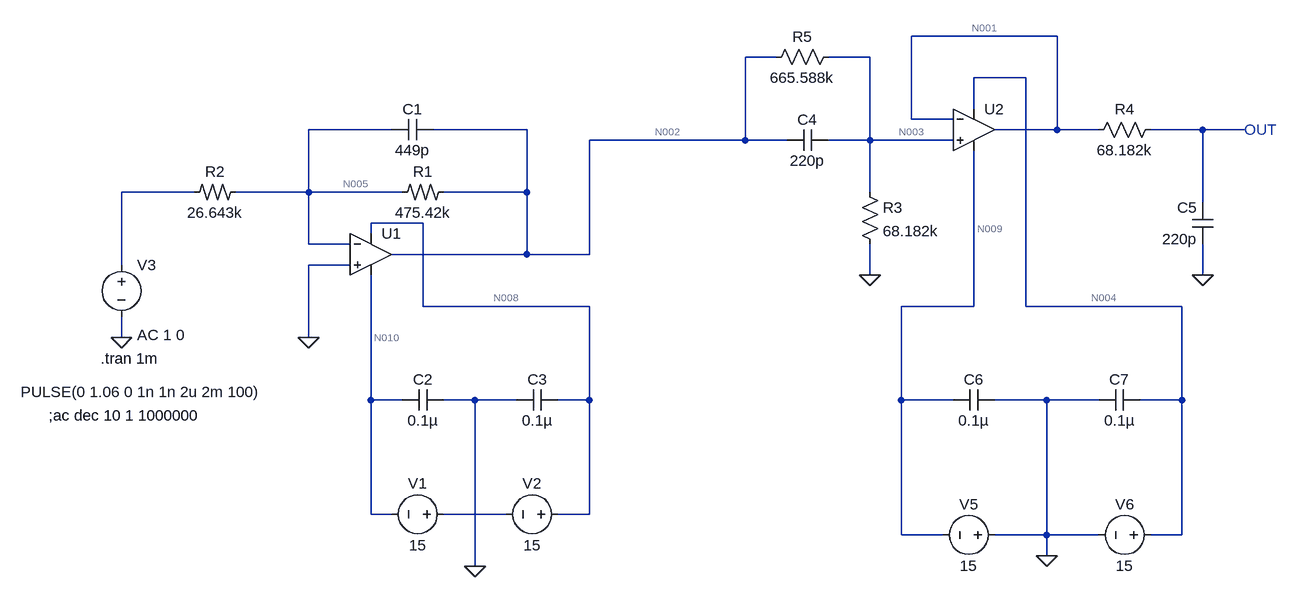
[diagram p0: schematic 3.asc]
3.asc, the LTspice schematic file:
Version 4
SHEET 1 1316 680
WIRE 976 -320 752 -320
WIRE 544 -288 496 -288
WIRE 688 -288 624 -288
WIRE 928 -256 848 -256
WIRE 848 -208 848 -256
WIRE 752 -192 752 -320
WIRE 816 -192 752 -192
WIRE -48 -176 -176 -176
WIRE 160 -176 16 -176
WIRE 976 -176 976 -320
WIRE 976 -176 880 -176
WIRE 1040 -176 976 -176
WIRE 1200 -176 1120 -176
WIRE 1264 -176 1200 -176
WIRE 496 -160 496 -288
WIRE 496 -160 256 -160
WIRE 560 -160 496 -160
WIRE 688 -160 688 -288
WIRE 688 -160 624 -160
WIRE 816 -160 688 -160
WIRE -352 -80 -464 -80
WIRE -176 -80 -176 -176
WIRE -176 -80 -288 -80
WIRE -32 -80 -176 -80
WIRE 160 -80 160 -176
WIRE 160 -80 32 -80
WIRE 688 -80 688 -160
WIRE 1200 -64 1200 -176
WIRE 0 -32 -80 -32
WIRE -80 -16 -80 -32
WIRE -176 0 -176 -80
WIRE -112 0 -176 0
WIRE 160 16 160 -80
WIRE 160 16 -48 16
WIRE 256 16 256 -160
WIRE 256 16 160 16
WIRE -464 32 -464 -80
WIRE -112 32 -176 32
WIRE 688 48 688 0
WIRE 1200 48 1200 0
WIRE 0 96 0 -32
WIRE 256 96 0 96
WIRE 848 96 848 -144
WIRE 848 96 736 96
WIRE 928 96 928 -256
WIRE 1168 96 928 96
WIRE -464 144 -464 112
WIRE -176 144 -176 32
WIRE -80 240 -80 48
WIRE -32 240 -80 240
WIRE 80 240 32 240
WIRE 144 240 80 240
WIRE 256 240 256 96
WIRE 256 240 208 240
WIRE 736 240 736 96
WIRE 816 240 736 240
WIRE 960 240 880 240
WIRE 1040 240 960 240
WIRE 1168 240 1168 96
WIRE 1168 240 1104 240
WIRE -80 416 -80 240
WIRE -48 416 -80 416
WIRE 128 416 32 416
WIRE 256 416 256 240
WIRE 256 416 208 416
WIRE 736 448 736 240
WIRE 800 448 736 448
WIRE 960 448 960 240
WIRE 960 448 880 448
WIRE 1040 448 960 448
WIRE 1168 448 1168 240
WIRE 1168 448 1120 448
WIRE 960 480 960 448
WIRE 80 496 80 240
FLAG -464 144 0
FLAG -176 144 0
FLAG 80 496 0
FLAG 960 480 0
FLAG 688 48 0
FLAG 1200 48 0
SYMBOL Opamps\\UniversalOpamp2 -80 16 R0
SYMATTR InstName U1
SYMATTR Value2 Avol=0.1Meg GBW=4Meg Slew=13Meg
SYMATTR SpiceLine2 en=0 enk=0 in=0 ink=0 Rin=1T
SYMBOL cap 16 -192 R90
WINDOW 0 0 32 VBottom 2
WINDOW 3 32 32 VTop 2
SYMATTR InstName C1
SYMATTR Value 449p
SYMBOL res2 32 -96 R90
WINDOW 0 0 32 VBottom 2
WINDOW 3 32 32 VTop 2
SYMATTR InstName R1
SYMATTR Value 475.42k
SYMBOL res2 -288 -96 R90
WINDOW 0 0 32 VBottom 2
WINDOW 3 32 32 VTop 2
SYMATTR InstName R2
SYMATTR Value 26.643k
SYMBOL cap 32 224 R90
WINDOW 0 0 32 VBottom 2
WINDOW 3 32 32 VTop 2
SYMATTR InstName C2
SYMATTR Value 0.1µ
SYMBOL cap 208 224 R90
WINDOW 0 0 32 VBottom 2
WINDOW 3 32 32 VTop 2
SYMATTR InstName C3
SYMATTR Value 0.1µ
SYMBOL voltage 48 416 R90
WINDOW 0 -32 56 VBottom 2
WINDOW 3 32 56 VTop 2
WINDOW 123 0 0 Left 0
WINDOW 39 0 0 Left 0
SYMATTR InstName V1
SYMATTR Value 15
SYMBOL voltage 224 416 R90
WINDOW 0 -32 56 VBottom 2
WINDOW 3 32 56 VTop 2
WINDOW 123 0 0 Left 0
WINDOW 39 0 0 Left 0
SYMATTR InstName V2
SYMATTR Value 15
SYMBOL voltage -464 16 R0
WINDOW 123 24 124 Left 2
WINDOW 39 0 0 Left 0
WINDOW 3 -155 212 Left 2
SYMATTR Value2 AC 1 0
SYMATTR Value PULSE(0 1.06 0 1n 1n 2u 2m 100)
SYMATTR InstName V3
SYMBOL cap 624 -176 R90
WINDOW 0 0 32 VBottom 2
WINDOW 3 32 32 VTop 2
SYMATTR InstName C4
SYMATTR Value 220p
SYMBOL cap 1216 0 R180
WINDOW 0 24 56 Left 2
WINDOW 3 24 8 Left 2
SYMATTR InstName C5
SYMATTR Value 220p
SYMBOL res 672 -96 R0
SYMATTR InstName R3
SYMATTR Value 68.182k
SYMBOL res 1136 -192 R90
WINDOW 0 0 56 VBottom 2
WINDOW 3 32 56 VTop 2
SYMATTR InstName R4
SYMATTR Value 68.182k
SYMBOL Opamps\\UniversalOpamp2 848 -176 R0
SYMATTR InstName U2
SYMATTR Value2 Avol=0.1Meg GBW=4Meg Slew=13Meg
SYMATTR SpiceLine2 en=0 enk=0 in=0 ink=0 Rin=1T
SYMBOL cap 880 224 R90
WINDOW 0 0 32 VBottom 2
WINDOW 3 32 32 VTop 2
SYMATTR InstName C6
SYMATTR Value 0.1µ
SYMBOL voltage 896 448 R90
WINDOW 0 -32 56 VBottom 2
WINDOW 3 32 56 VTop 2
WINDOW 123 0 0 Left 0
WINDOW 39 0 0 Left 0
SYMATTR InstName V5
SYMATTR Value 15
SYMBOL voltage 1136 448 R90
WINDOW 0 -32 56 VBottom 2
WINDOW 3 32 56 VTop 2
WINDOW 123 0 0 Left 0
WINDOW 39 0 0 Left 0
SYMATTR InstName V6
SYMATTR Value 15
SYMBOL cap 1104 224 R90
WINDOW 0 0 32 VBottom 2
WINDOW 3 32 32 VTop 2
SYMATTR InstName C7
SYMATTR Value 0.1µ
SYMBOL res 640 -304 R90
WINDOW 0 0 56 VBottom 2
WINDOW 3 32 56 VTop 2
SYMATTR InstName R5
SYMATTR Value 665.588k
TEXT -496 176 Left 2 !.tran 1m
TEXT -576 264 Left 2 !;ac dec 10 1 1000000
TEXT 1264 -176 Left 2 ;OUT

The netlist it stands for:
* 3.asc
XU1 0 N005 N008 N010 N002 level.2 Avol=0.1Meg GBW=4Meg Slew=13Meg ilimit=25m rail=0 Vos=0 phimargin=45 en=0 enk=0 in=0 ink=0 Rin=1T  ; pins IN+ IN- V+ V- OUT
C1 N002 N005 449p
R1 N002 N005 475.42k
R2 N005 N007 26.643k
C2 0 N010 0.1µ
C3 N008 0 0.1µ
V1 N011 N010 15
V2 N008 N011 15
V3 N007 0 PULSE(0 1.06 0 1n 1n 2u 2m 100) AC 1 0
C4 N003 N002 220p
C5 0 N006 220p
R3 N003 0 68.182k
R4 N006 N001 68.182k
XU2 N003 N001 N004 N009 N001 level.2 Avol=0.1Meg GBW=4Meg Slew=13Meg ilimit=25m rail=0 Vos=0 phimargin=45 en=0 enk=0 in=0 ink=0 Rin=1T  ; pins IN+ IN- V+ V- OUT
C6 0 N009 0.1µ
V5 0 N009 15
V6 N004 0 15
C7 N004 0 0.1µ
R5 N003 N002 665.588k
.tran 1m
;ac dec 10 1 1000000
* OUT
.lib UniversalOpamps2.sub
.backanno
.end

* Results of the author's LTspice run, read from the files saved beside the schematic
* Operating Point, zero values left out:
*   V(n008) = 15 V
*   V(n010) = -15 V
*   V(n004) = 15 V
*   V(n009) = -15 V
*   I(V6) = -1.498 mA
*   I(V5) = -1.498 mA
*   I(V2) = -1.498 mA
*   I(V1) = -1.498 mA
*   Ix(u1:3) = 1.498 mA
*   Ix(u1:4) = -1.498 mA
*   Ix(u2:3) = 1.498 mA
*   Ix(u2:4) = -1.498 mA
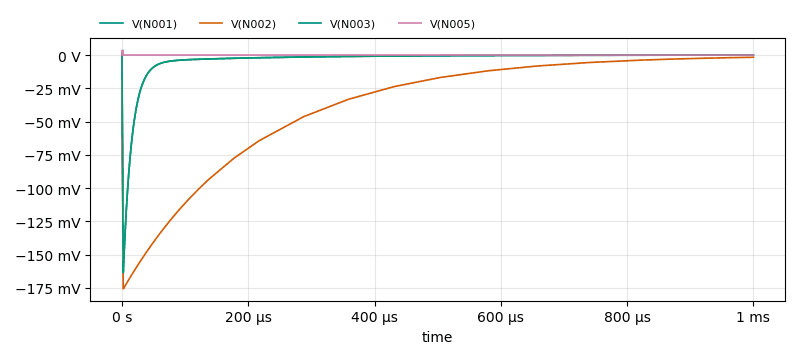
[diagram p1: Transient Analysis of 3.asc, plotted from the saved traces]
* Transient Analysis, 1 run:
*   V(N001): min -163.1 mV, max 40.99 µV, average -3.514 mV, rms 14.75 mV, last -52.22 µV
*   V(N002): min -175.7 mV, max 293.6 µV, average -37.63 mV, rms 57.93 mV, last -1.665 mV
*   V(N003): min -163.7 mV, max 293.6 µV, average -3.514 mV, rms 14.76 mV, last -52.28 µV
*   V(N005): min -32.05 µV, max 3.514 mV, average 440.9 nV, rms 155.4 µV, last -286.9 nV